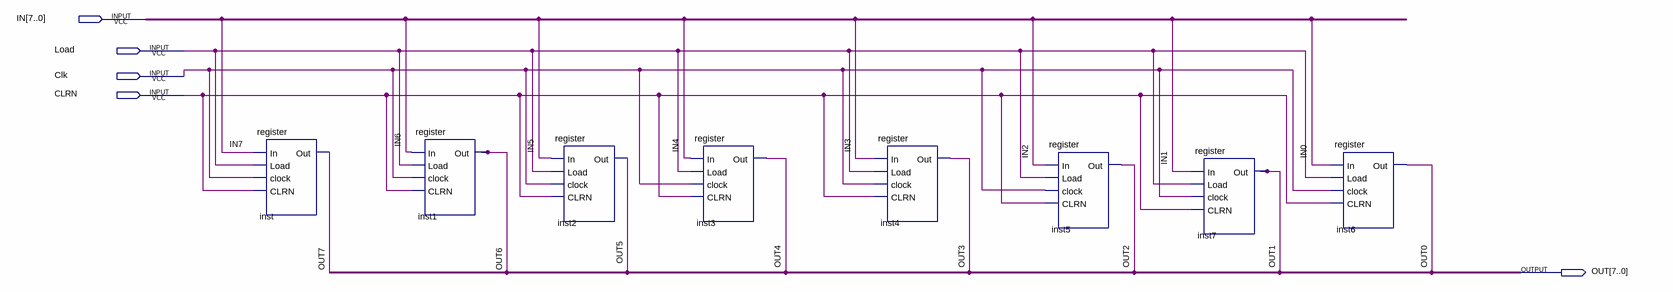
[diagram p0: schematic sheet]
// Quartus schematic 8bitregister.bdf as structural Verilog: 8 symbols, 5 pins
module \8bitregister  (
  input  [7:0] IN,
  input  Load,
  input  Clk,
  input  CLRN,
  output [7:0] OUT
);

  register inst (.In(IN[7]), .Load(Load), .clock(Clk), .CLRN(CLRN), .Out(OUT[7]));
  register inst1 (.In(IN[6]), .Load(Load), .clock(Clk), .CLRN(CLRN), .Out(OUT[6]));
  register inst2 (.In(IN[5]), .Load(Load), .clock(Clk), .CLRN(CLRN), .Out(OUT[5]));
  register inst3 (.In(IN[4]), .Load(Load), .clock(Clk), .CLRN(CLRN), .Out(OUT[4]));
  register inst4 (.In(IN[3]), .Load(Load), .clock(Clk), .CLRN(CLRN), .Out(OUT[3]));
  register inst5 (.In(IN[2]), .Load(Load), .clock(Clk), .CLRN(CLRN), .Out(OUT[2]));
  register inst7 (.In(IN[1]), .Load(Load), .clock(Clk), .CLRN(CLRN), .Out(OUT[1]));
  register inst6 (.In(IN[0]), .Load(Load), .clock(Clk), .CLRN(CLRN), .Out(OUT[0]));
endmodule
